# Altium schematic sheet A4988SETTR-T.SchDoc
size Letter; SheetNumber: 2; SheetTotal: 3
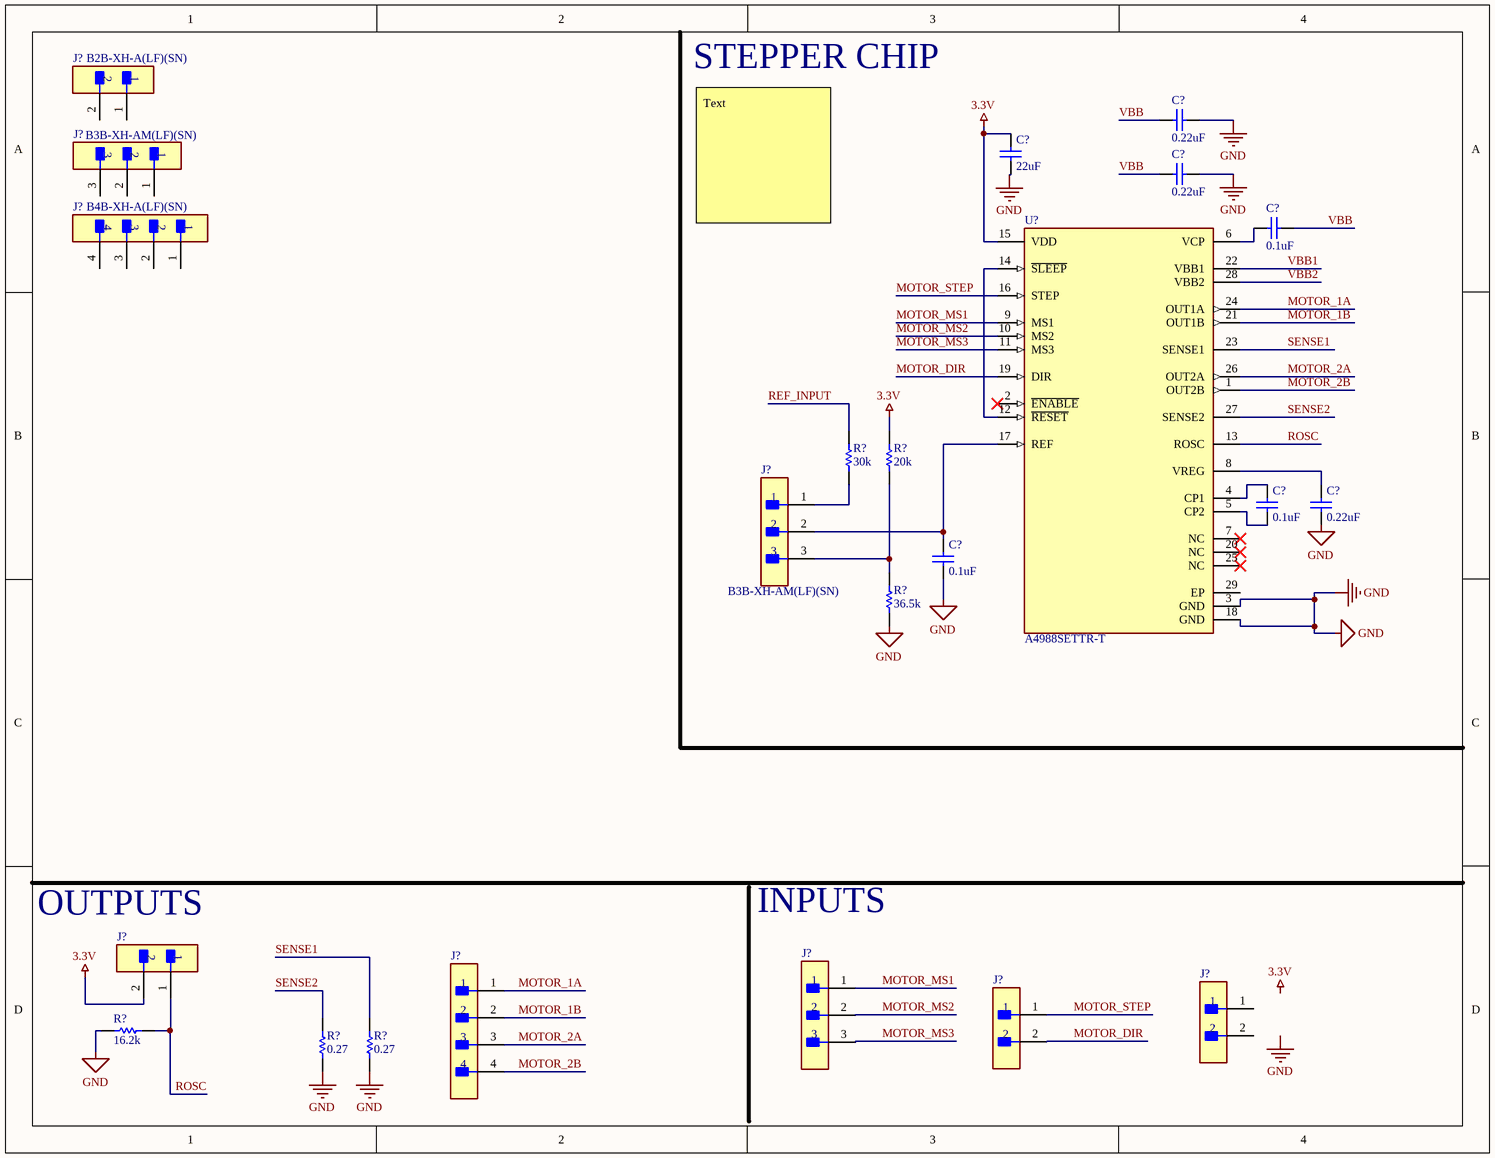
[diagram p0: A4988SETTR-T.SchDoc]

## Parts
(Parts that share a designator on the sheet are numbered #1, #2 ... from top to bottom, then left to right.)
C?#1  value 0.22uF  (hidden comment: Capacitor)
C?#2  value 22uF  (hidden comment: Capacitor)
C?#3  value 0.22uF  (hidden comment: Capacitor)
C?#4  value 0.1uF  (hidden comment: Capacitor)
C?#5  value 0.1uF  (hidden comment: Capacitor)
C?#6  value 0.22uF  (hidden comment: Capacitor)
C?#7  value 0.1uF  (hidden comment: Capacitor)
J?#1  B2B-XH-A(LF)(SN)  [FP-B2B-XH-A_LF_SN-MFG]
J?#2  B3B-XH-AM(LF)(SN)  [FP-B3B-XH-AM_LF_SN-MFG]
J?#3  B4B-XH-A(LF)(SN)  [FP-B4B-XH-A_LF_SN-MFG]
J?#4  B3B-XH-AM(LF)(SN)  [FP-B3B-XH-AM_LF_SN-MFG]
J?#5  B4B-XH-A(LF)(SN)  [FP-B4B-XH-A_LF_SN-MFG]  (value not drawn)
J?#6  B3B-XH-AM(LF)(SN)  [FP-B3B-XH-AM_LF_SN-MFG]  (value not drawn)
J?#7  B2B-XH-A(LF)(SN)  [FP-B2B-XH-A_LF_SN-MFG]  (value not drawn)
J?#8  B2B-XH-A(LF)(SN)  [FP-B2B-XH-A_LF_SN-MFG]  (value not drawn)
J?#9  B2B-XH-A(LF)(SN)  [FP-B2B-XH-A_LF_SN-MFG]  (value not drawn)
R?#1  value 30k  (hidden comment: Resistor)
R?#2  value 20k  (hidden comment: Resistor)
R?#3  value 36.5k  (hidden comment: Resistor)
R?#4  value 16.2k  (hidden comment: Resistor)
R?#5  value 0.27  (hidden comment: Resistor)
R?#6  value 0.27  (hidden comment: Resistor)
U?  A4988SETTR-T  [FP-ET-28-MFG]

## Nets
3.3V: C?#2.2 J?#7.2 R?#2.1 U?.15(VDD)
GND: C?#1.1 C?#2.1 C?#3.1 C?#6.1 C?#7.1 R?#3.2 R?#4.2 R?#5.1 R?#6.1 U?.3(GND) U?.18(GND)
MOTOR_1A: J?#5.1 U?.24(OUT1A)
MOTOR_1B: J?#5.2 U?.21(OUT1B)
MOTOR_2A: J?#5.3 U?.26(OUT2A)
MOTOR_2B: J?#5.4 U?.1(OUT2B)
MOTOR_DIR: J?#9.2 U?.19(DIR)
MOTOR_MS1: J?#6.1 U?.9(MS1)
MOTOR_MS2: J?#6.2 U?.10(MS2)
MOTOR_MS3: J?#6.3 U?.11(MS3)
MOTOR_STEP: J?#9.1 U?.16(STEP)
REF_INPUT: R?#1.1
ROSC: J?#7.1 R?#4.1 U?.13(ROSC)
SENSE1: R?#6.2 U?.23(SENSE1)
SENSE2: R?#5.2 U?.27(SENSE2)
VBB: C?#1.2 C?#3.2 C?#4.1
VBB1: U?.22(VBB1)
VBB2: U?.28(VBB2)
NetC?#4_2: C?#4.2 U?.6(VCP)
NetC?#5_1: C?#5.1 U?.5(CP2)
NetC?#5_2: C?#5.2 U?.4(CP1)
NetC?#6_2: C?#6.2 U?.8(VREG)
NetC?#7_2: C?#7.2 J?#4.2 U?.17(REF)
NetJ?#4_1: J?#4.1 R?#1.2
NetJ?#4_3: J?#4.3 R?#2.2 R?#3.1
NetU?_12: U?.12(~{RESET}) U?.14(~{SLEEP})

Not connected (* = marked no-connect by the designer): J?#1 1 2; J?#2 1 2 3; J?#3 1 2 3 4; J?#8 1 2; U? 2(~{ENABLE})* 7(NC)* 20(NC)* 25(NC)* 29(EP)

## Notes on the sheet
- STEPPER CHIP
- Text
- (near J?#7) OUTPUTS
- INPUTS
- Labels drawn without touching a wire or pin: 3.3V, GND

## Library data of the parts
C?#1-C?#7 = Capacitor: SimulationGenericComponent: True
J?#1 J?#7-J?#9 = CMP-2000-05888-3: CONN HEADER VERT 2POS 2.5MM; Current Rating: 3A; Voltage Rating: 250V; Number of Contacts: 2; Contact Resistance: 20mR; Wire/Cable Gauge: 22AWG; Insulation Resistance: 1GR; Connector Type: Male Pin; Packaging: Bulk; Contact Material: Brass; Lead Free: Lead Free; Orientation: Straight; Contact Plating: Tin; Max Current Rating: 3A; Termination: Solder; Fastening Type: Detent; Depth: 5.75mm; Housing Material: Polyamide; REACH SVHC: No SVHC; Series: XH; Voltage Rating (AC): 250V; Number of Positions: 2; Color: Natural; Contact Type: Male Pin; Max Voltage Rating (DC): 250V; Pitch: 2.5mm; Lead Pitch: 2.5mm; Mount: Through Hole; Max Operating Temperature: 85°C; Length: 7.4mm; Max Voltage Rating (AC): 250V; Min Operating Temperature: -25°C; Number of Rows: 1; Housing Color: White
J?#2 J?#4 J?#6 = CMP-17438-000009-1: CONN HEADER VERT 3POS 2.5MM; Max Current Rating: 3A; Gender: Male; Max Voltage Rating (AC): 250V; Connector Type: Male Pin; Pitch: 0.098inch; Number of Positions: 3; Contact Resistance: 20mR; Termination: Press-Fit; Housing Color: White; Housing Material: Polyamide; Orientation: Straight; Contact Material: Brass; Contact Type: Male Pin; Color: Natural; Packaging: Bulk; Lead Free: Lead Free; Depth: 5.75mm; Number of Rows: 1; Contact Plating: Tin; Length: 9.9mm; Max Operating Temperature: 85°C; Series: XH; Min Operating Temperature: -25°C; Fastening Type: Detent; Mount: Through Hole
J?#3 J?#5 = CMP-17439-000250-1: CONN HEADER VERT 4POS 2.5MM; Number of Contacts: 4; Contact Resistance: 20mR; Voltage Rating: 250V; Max Current Rating: 3A; Gender: Male; Wire/Cable Gauge: 22AWG; Mated Stacking Heights: 9.8mm; Insulation Resistance: 1GR; Orientation: Straight; Contact Type: Male Pin; Contact Finish - Mating: TIN; Series: XH; Max Voltage Rating (AC): 250V; Lead Pitch: 2.5mm; Contact Shape: Square; Insulation Color: Natural; Termination: Solder; Lead Free: Lead Free; Voltage Rating (AC): 250V; Number of Rows: 1; Flammability Rating: UL94 V-0; Number of Positions: 4; Max Operating Temperature: 85°C; Package Quantity: 500; Mount: Through Hole; REACH SVHC: No SVHC; Connector Type: Header; Insulation Material: Nylon; Fastening Type: Detent; Min Operating Temperature: -25°C; Housing Color: White; Packaging: Bulk; Contact Plating: Tin; Contact Material: Brass; Max Voltage Rating (DC): 250V; Housing Material: Polyamide; Color: Natural; Material: Polyamide; Pitch: 2.5mm; Depth: 5.75mm; Current Rating: 3A; Length: 12.4mm
R?#1-R?#6 = Resistor: TC1: 0; SimulationGenericComponent: True; TC2: 0
U? = CMP-1742-00003-2: IC MTR DRVR BIPOLAR 3-5.5V 28QFN; Number of Outputs: 1; Motor Type: Stepper; Output Current: 2A; Min Supply Voltage: 8V; Output Voltage: 35V; Package Quantity: 1; Max Operating Temperature: 85°C; Case/Package: QFN EP; Mount: Surface Mount; Packaging: Tape and Reel; Radiation Hardening: No; REACH SVHC: No SVHC; Min Operating Temperature: -20°C; Max Supply Voltage: 35V; Number of Pins: 28